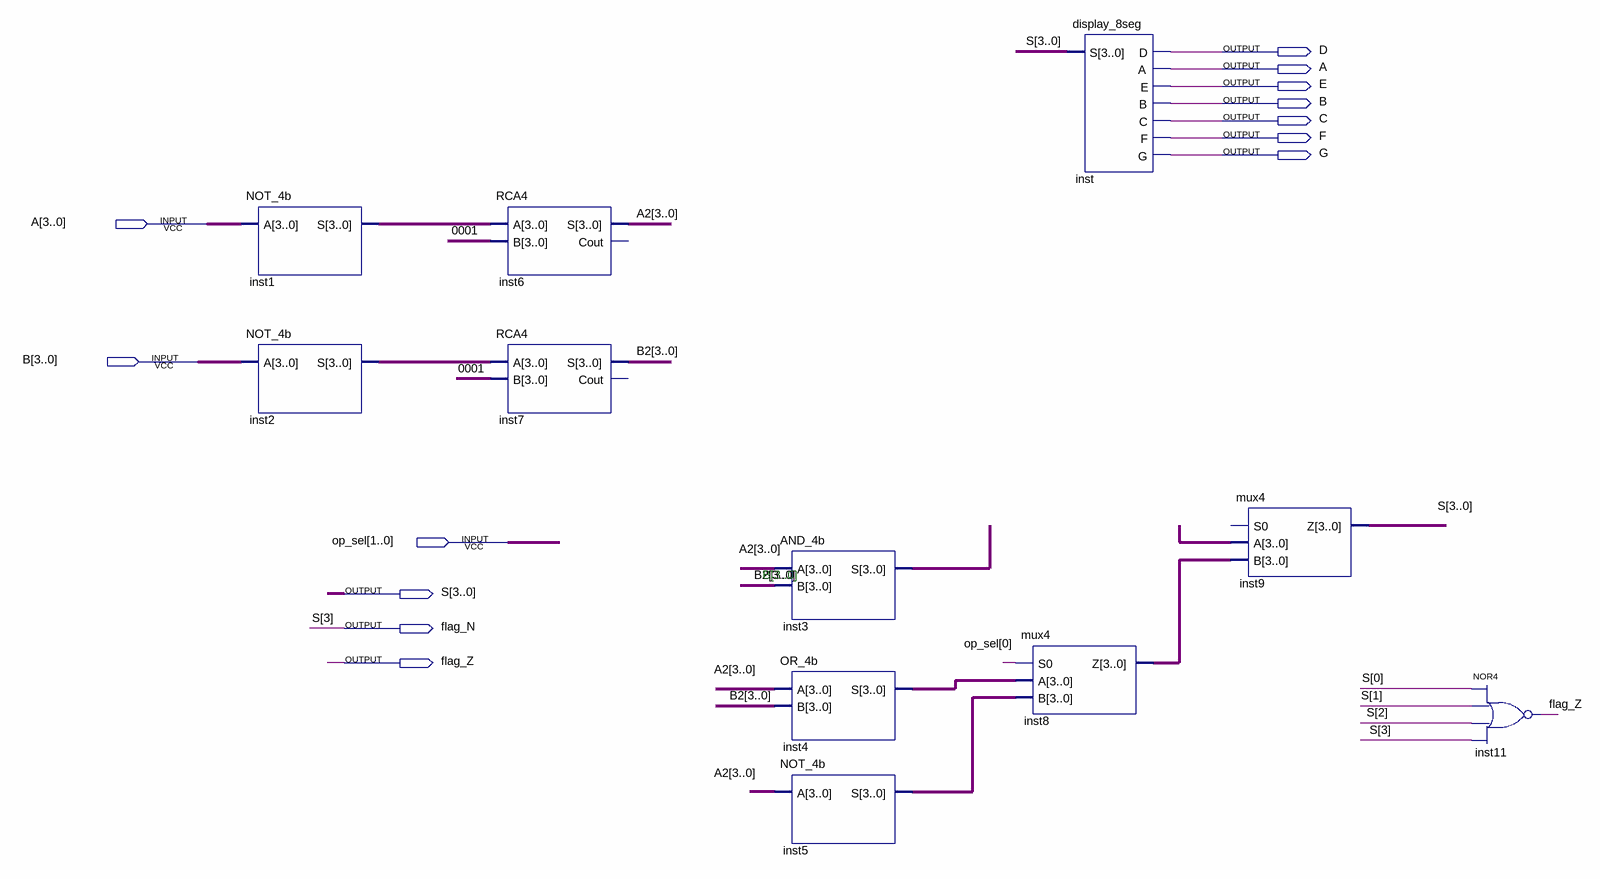
[diagram p0: schematic sheet]
// Quartus schematic ULA_display.bdf as structural Verilog: 11 symbols, 13 pins
module ULA_display (
  input  [3:0] A,
  input  [3:0] B,
  input  [1:0] op_sel,
  output D,
  output A_1bit,
  output E,
  output B_1bit,
  output C,
  output F,
  output G,
  output [3:0] S,
  output flag_N,
  output flag_Z
);

  wire \0001 ;
  wire [3:0] A2, B2, inst1_s, inst2_s, inst3_s, inst4_s, inst5_s, inst8_z, undriven;

  NOT_4b inst1 (.A(A), .S(inst1_s));
  NOT_4b inst2 (.A(B), .S(inst2_s));
  RCA4 inst6 (.A(inst1_s), .B({4{\0001 }}), .S(A2));  // open: Cout
  RCA4 inst7 (.A(inst2_s), .B({4{\0001 }}), .S(B2));  // open: Cout
  AND_4b inst3 (.A(A2), .B(B2), .S(inst3_s));
  OR_4b inst4 (.A(A2), .B(B2), .S(inst4_s));
  NOT_4b inst5 (.A(A2), .S(inst5_s));
  display_8seg inst (.S({flag_N, S[2:0]}), .D(D), .A(A_1bit), .E(E), .B(B_1bit), .C(C), .F(F), .G(G));
  mux4 inst8 (.S0(op_sel[0]), .A(inst4_s), .B(inst5_s), .Z(inst8_z));
  mux4 inst9 (.A(undriven), .B(inst8_z), .Z({flag_N, S[2:0]}));  // open: S0
  nor inst11 (flag_Z, S[0], S[1], S[2], flag_N);

  assign S[3] = flag_N;

  // Notes on the sheet:
  //   B[3..0]
endmodule
